# EAGLE design plant-monitor (EAGLE 9.6.1)
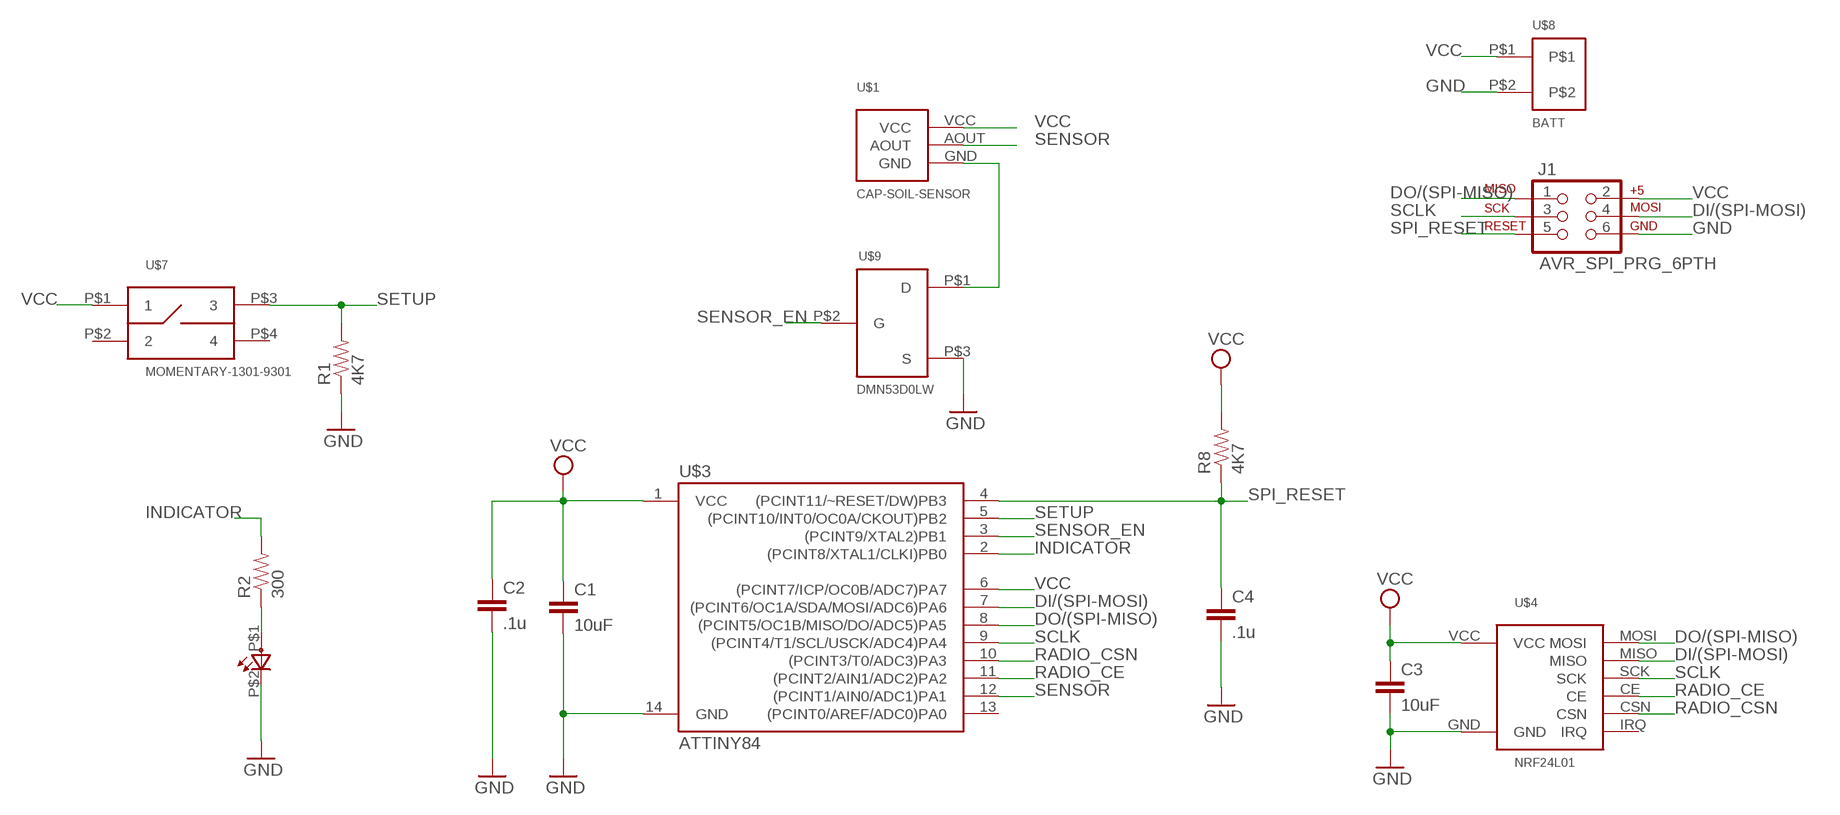
[diagram p0: schematic, sheet 1]

## Parts
C1  10uF  10UF-1206-6.3V-20%  [1206]
C2  .1u  CAP0805  [0805]
C3  10uF  10UF-1206-6.3V-20%  [1206]
C4  .1u  CAP0805  [0805]
J1  AVR_SPI_PRG_6PTH  [2X3]
R1  4K7  RESISTOR  [0805]
R2  300  RESISTOR  [0805]
R8  4K7  RESISTOR  [0805]
U$1  CAP-SOIL-SENSOR  [CAP-SOIL-SENSOR]
U$3  ATTINY84  [SO14]
U$4  NRF24L01  [NRF24L01]
U$6  LED  [0805]
U$7  MOMENTARY-1301-9301  [MOMENTARY-1301]
U$8  BATT  JST-PH-2  [JST-PH-2]
U$9  DMN53D0LW  [SOT-323]

## Nets
DI/(SPI-MOSI): J1.4 U$3.7((PCINT6/OC1A/SDA/MOSI/ADC6)PA6) U$4.MISO
DO/(SPI-MISO): J1.1 U$3.8((PCINT5/OC1B/MISO/DO/ADC5)PA5) U$4.MOSI
GND: C1.2 C2.2 C3.2 C4.2 J1.6 R1.1 U$3.14(GND) U$4.GND U$6.P$2(C) U$8.P$2 U$9.P$3(S)
INDICATOR: R2.2 U$3.2((PCINT8/XTAL1/CLKI)PB0)
N$1: R2.1 U$6.P$1(A)
N$5: U$1.GND U$9.P$1(D)
RADIO_CE: U$3.11((PCINT2/AIN1/ADC2)PA2) U$4.CE
RADIO_CSN: U$3.10((PCINT3/T0/ADC3)PA3) U$4.CSN
SCLK: J1.3 U$3.9((PCINT4/T1/SCL/USCK/ADC4)PA4) U$4.SCK
SENSOR: U$1.AOUT U$3.12((PCINT1/AIN0/ADC1)PA1)
SENSOR_EN: U$3.3((PCINT9/XTAL2)PB1) U$9.P$2(G)
SETUP: R1.2 U$3.5((PCINT10/INT0/OC0A/CKOUT)PB2) U$7.P$3
SPI_RESET: C4.1 J1.5 R8.1 U$3.4((PCINT11/~RESET/DW)PB3)
VCC: C1.1 C2.1 C3.1 J1.2 R8.2 U$1.VCC U$3.1(VCC) U$3.6((PCINT7/ICP/OC0B/ADC7)PA7) U$4.VCC U$7.P$1 U$8.P$1
Unconnected: U$3.13((PCINT0/AREF/ADC0)PA0) U$4.IRQ U$7.P$2 U$7.P$4

## Library data of the parts
C1 C3 = SparkFun-Capacitors:10UF: 10.0µF ceramic capacitors A capacitor is a passive two-terminal electrical component used to store electrical energy temporarily in an electric field.; PROD_ID: CAP-10057
C2 C4 = SparkFun:CAP: Capacitor Standard 0603 ceramic capacitor, and 0.1" leaded capacitor.
J1 = SparkFun-Connectors:AVR_SPI_PRG_6: AVR ISP 6 Pin This is the reduced ISP connector for AVR programming. Common on Arduino. This footprint will take up less PCB space and can be used with a 10-pin to 6-pin adapter such as SKU: BOB-08508
R1 R2 R8 = SparkFun:RESISTOR: Resistor Basic schematic elements and footprints for 0603, 1206, and PTH 1/10th watt (small) resistors.
U$1 = GARTH:CAP-SOIL-SENSOR
U$3 = SparkFun-IC-Microcontroller:ATTINY84: Atmel 14-pin 2/4/8kB flash uC Datasheet <https://cdn.sparkfun.com/datasheets/Widgets/doc8006.pdf> SparkFun Products Tiny AVR Programmer <https://www.sparkfun.com/products/11801> (PGM-11801) SparkFun Servo Trigger - Continuous Rotation <https://www.sparkfun.com/products/13872> (WIG-13872) SparkFun Servo Trigger <https://www.sparkfun.com/products/13118> (WIG-13118); PROD_ID: IC-11285
U$4 = GARTH:NRF24L01
U$6 = GARTH:LED
U$7 = GARTH:MOMENTARY-1301
U$8 = GARTH:JST-PH-2
U$9 = GARTH:DMN53D0LW

## Board
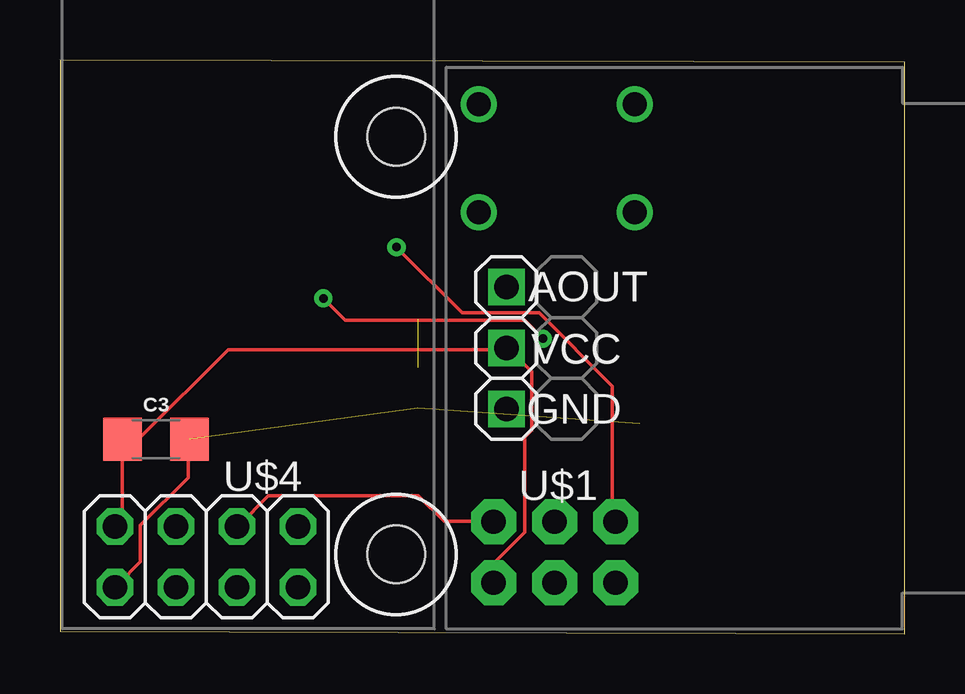
[diagram p1: board, top side]
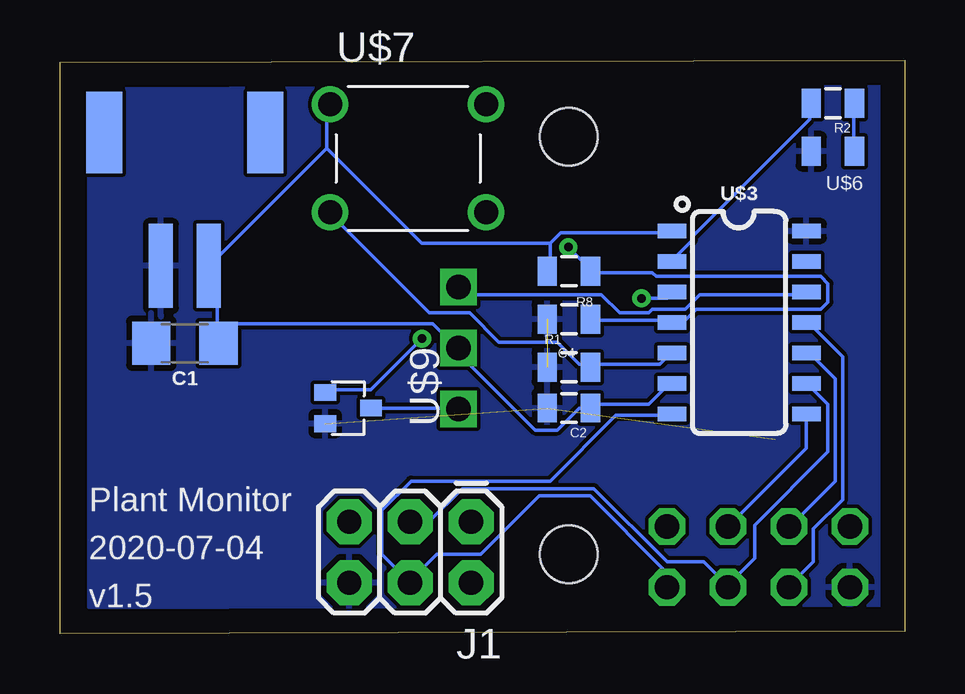
[diagram p2: board, bottom side, seen from below]

Size 35.2 x 23.9 mm. Coordinates in mm from the lower left corner, seen from the top.
Outline: 0,0.1 35.2,0 35.2,23.8 0,23.9 0,0.1
Copper layers (1*16): Top 0.035mm / dielectric 1.5mm / Bottom 0.035mm
Design rules "default": minimum track width 6mil, minimum drill 0.35mm, track to track 6mil, track to pad 6mil, pad to pad 6mil, via to via 6mil, smd to smd 6mil, copper to edge 40mil, drill to drill 6mil, minimum pad ring 10mil, minimum via ring 8mil, stop-mask expansion 4mil, vias tented up to drill 0mil, thermal gap 10mil
Holes 2.4 mm at 14,3.3 14,20.7

### Footprints (pad centres in the part's own frame; a part is rotated, then mirrored left to right if it is on the bottom)
1206 = smd 1.6 x 1.8: 1 -1.4,0; 2 1.4,0
0805 = smd 0.8 x 1.2: 1 -0.9,0; 2 0.9,0
2X3 = drill 1.016 pad 1.88 octagon: 1 0,0; 2 0,2.54; 3 2.54,0; 4 2.54,2.54; 5 5.08,0; 6 5.08,2.54
CAP-SOIL-SENSOR = drill 1.016 square: AOUT 2.54,0; GND -2.54,0; VCC 0,0
SO14 = smd 0.6 x 1.2: 1 -3.175,-2.8; 2 -1.905,-2.8; 3 -0.635,-2.8; 4 0.635,-2.8; 5 1.905,-2.8; 6 3.175,-2.8; 7 4.445,-2.8; 8 4.445,2.8; 9 3.175,2.8; 10 1.905,2.8; 11 0.635,2.8; 12 -0.635,2.8; 13 -1.905,2.8; 14 -3.175,2.8
NRF24L01 = drill 1.016 octagon: CE 1.27,1.27; CSN 1.27,-1.27; GND 3.81,1.27; IRQ -3.81,-1.27; MISO -3.81,1.27; MOSI -1.27,-1.27; SCK -1.27,1.27; VCC 3.81,-1.27
0805' = smd 0.8 x 1.2: P$1 -0.9,0; P$2 0.9,0
MOMENTARY-1301 = drill 1: P$1 -3.25,2.25; P$2 3.25,2.25; P$3 -3.25,-2.25; P$4 3.25,-2.25
JST-PH-2 = smd 1 x 3.5: P$1 -1,2.775; P$2 1,2.775 | smd 1.5 x 3.4: P$3 -3.35,-2.775; P$4 3.35,-2.775
SOT-323 = smd 0.7 x 0.9: P$1 0,0.95; P$2 -0.65,-0.95; P$3 0.65,-0.95

### Placement (x,y rotation side)
C1  30,12.1 180 bottom
C2  14,9.4 180 bottom
C3  4,8.1 0 top
C4  14,13.1 180 bottom
J1  18.07,4.66 180 bottom
R1  14,11.1 0 bottom
R2  3,22.1 180 bottom
R8  14,15.1 180 bottom
U$1  18.6,11.9 90 top
U$3  6.9,13.6 270 bottom
U$4  6.1,3.2 180 top
U$6  LED  [0805']  3,20.1 180 bottom
U$7  20.7,19.8 0 bottom
U$8  30,18.1 180 bottom
U$9  23.2,9.4 270 bottom

### Tracks (layer width: path | path; a pad name or v marks a point on that pad's centre or on a via)
DI/(SPI-MOSI)
  Bottom 0.152: U$3.7 9.75,9.09 12.04,9.09 14.78,6.35 20.57,6.35 21.79,5.13 21.79,3.3 20.73,2.23 J1.4 20.57,2.23 19.51,3.3 17.68,3.3 15.24,5.74 13.11,5.74 10.06,2.69 10.06,2.08 U$4.MISO
DO/(SPI-MISO)
  Top 0.152: J1.1 17.98,4.67 16,4.67 14.94,5.74 8.69,5.74 7.47,4.52 U$4.MOSI
  Bottom 0.152: U$3.8 4.12,9.09 4.12,7.72 7.32,4.52 U$4.MOSI
GND  (3 unrouted)
  Top 0.152: C3.2 5.33,8.03 5.33,6.5 3.35,4.52 3.35,3 2.44,2.08 U$4.GND
  pour Bottom: 1,23.1 1,1.1 34,1.1 34,23.1
INDICATOR
  Bottom 0.152: R2.2 3.96,22.05 3.96,21.44 8.84,16.56 8.84,16.41 9.6,15.64 U$3.2
N$1
  Bottom 0.152: U$6.P$1 2.13,20.22 2.13,22.05 R2.1
N$5
  Bottom 0.152: U$9.P$1 22.1,9.4 18.75,9.4 U$1.GND
RADIO_CE
  Bottom 0.152: U$3.11 3.96,12.9 2.59,11.53 2.59,5.59 3.81,4.37 3.81,3 4.72,2.08 U$4.CE
RADIO_CSN
  Bottom 0.152: U$3.10 3.96,11.68 2.9,10.62 2.9,6.35 4.72,4.52 U$4.CSN
SCLK
  Bottom 0.152: U$3.9 3.96,10.31 3.2,9.55 3.2,7.57 6.25,4.52 6.25,3.15 7.32,2.08 U$4.SCK 7.47,2.08 8.38,3 9.91,3 12.95,6.04 18.44,6.04 19.81,4.67 20.57,4.67 J1.3
SENSOR
  Bottom 0.152: U$3.12 4.12,14.12 8.53,14.12 9.14,13.51 10.52,13.51 10.67,13.36 11.89,13.36 12.65,14.12 18.29,14.12 18.59,14.43 U$1.AOUT
SENSOR_EN  (via drill 0.35)
  Top 0.152: v20.12,12.29 19.36,13.05 11.89,13.05 v10.97,13.97
  Bottom 0.152: v20.12,12.29 22.25,10.16 24.08,10.16 U$9.P$2 | v10.97,13.97 9.91,13.97 9.75,14.12 U$3.3
SETUP
  Bottom 0.152: U$3.5 9.75,11.68 10.21,11.22 12.95,11.22 R1.2 13.11,11.22 13.56,11.22 14.48,12.14 16.92,12.14 18.14,13.36 19.81,13.36 23.93,17.47 U$7.P$3
SPI_RESET  (via drill 0.35)
  Top 0.152: v14.02,16.1 16.76,13.36 19.96,13.36 23.01,10.31 23.01,4.67 J1.5
  Bottom 0.152: C4.1 12.95,13.05 9.75,13.05 U$3.4 9.6,13.05 9.14,13.05 8.69,13.51 3.5,13.51 3.2,13.82 3.2,14.58 3.5,14.88 10.36,14.88 10.52,15.04 12.95,15.04 R8.1 13.11,15.19 v14.02,16.1
VCC
  Top 0.152: U$4.VCC 2.44,4.52 2.59,4.67 2.59,8.03 C3.1 2.74,8.18 3.35,8.18 7.01,11.83 18.59,11.83 U$1.VCC 18.75,11.83 19.66,10.92 19.66,8.48 19.36,8.18 19.36,4.21 18.14,3 18.14,2.23 J1.2
  Bottom 0.152: U$3.6 9.75,10.46 10.67,9.55 12.95,9.55 C2.1 13.56,9.4 14.48,8.48 15.39,8.48 18.75,11.83 U$1.VCC 18.75,11.99 19.66,12.9 28.65,12.9 | 14.78,16.25 14.78,15.19 R8.2 | 14.78,16.25 14.33,16.71 9.75,16.71 U$3.1 | 28.65,12.9 28.65,14.88 28.96,15.19 U$8.P$1 28.96,15.34 24.08,20.22 | 28.65,12.9 28.65,12.14 C1.1 28.65,12.9 | 24.08,20.22 24.08,22.05 U$7.P$1 | 14.78,16.25 20.12,16.25 24.08,20.22

### Text on the board
bPlace: Plant Monitor | 2020-07-04 | v1.5